# Altium schematic sheet 1N4148WS_C7420319.schdoc
size 127 x 101 mm
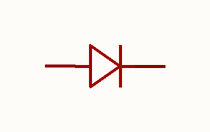
[diagram p0: 1N4148WS_C7420319.schdoc]

## Parts
D?  1n4148ws_c7420319  [SOD-323_L1.7-W1.3-LS2.5-FD]  (value not drawn)

## Nets

Not connected (* = marked no-connect by the designer): D? 1(A) 2(K)

## Library data of the parts
D? = 1n4148ws_c7420319: 二极管配置:独立式;整流电流:150mA;直流反向耐压(Vr):100V;正向压降(Vf):1.25V@150mA;反向恢复时间(Trr):4ns;; Manufacturer: R+O(宏嘉诚); AddInBom: yes; ModelId: 0f2f330c645944df9245ac3c3fec3456; ModelTransform: 98.425,49.2125,0,180,0,0,0,0,0; Diode Configuration: 独立式; Pd - Power Dissipation: 200mW; Current - Rectified: 150mA; Voltage - DC Reverse(Vr): 100V; Non-Repetitive Peak Forward Surge Current: 2A; Reverse Leakage Current (Ir): 1uA@75V; Reverse Recovery Time (trr): 4ns; Operating Junction Temperature Range: -55℃~+150℃; Symbol: 1N4148WS_C7420319; LCSC Part Name: 100V 150mA; SupplierPart: C7420319; ManufacturerPart: 1N4148WS; Supplier Footprint: SOD-323; JLCPCB Part Class: Extended Part; Datasheet: https://item.szlcsc.com/datasheet/1N4148WS/8397141.html; Supplier: LCSC; ConvertToPcb: yes; FootprintName: SOD-323_L1.7-W1.3-LS2.5-FD; ModelName: SOD-323_L1.7-W1.3-LS2.5-FD; Voltage - Forward(Vf@If): 1.25V@150mA